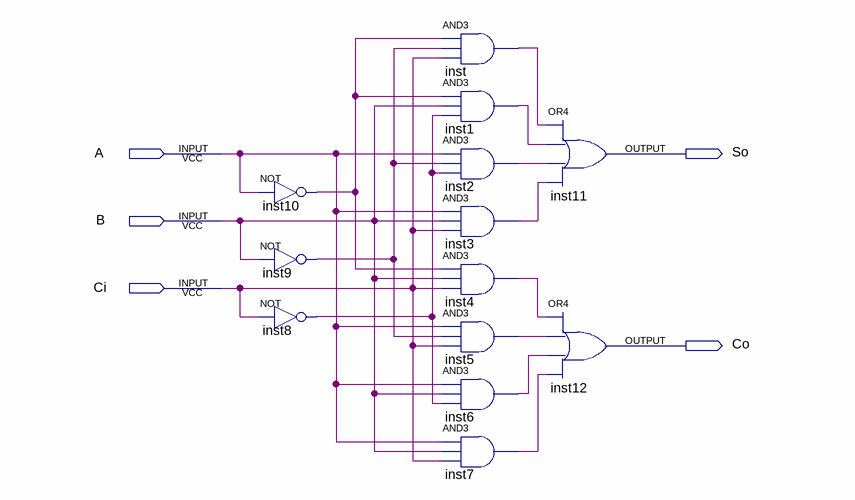
[diagram p0: schematic sheet]
// Quartus schematic Full_adder.bdf as structural Verilog: 13 symbols, 5 pins
module Full_adder (
  input  A,
  input  B,
  input  Ci,
  output So,
  output Co
);

  wire inst1_out, inst2_out, inst3_out, inst4_out, inst5_out, inst6_out, inst7_out, inst8_out, inst9_out,
       inst10_out, inst_out;

  not inst10 (inst10_out, A);
  not inst9 (inst9_out, B);
  not inst8 (inst8_out, Ci);
  and inst (inst_out, inst10_out, inst9_out, Ci);
  and inst1 (inst1_out, inst10_out, B, inst8_out);
  and inst2 (inst2_out, A, inst9_out, inst8_out);
  and inst3 (inst3_out, A, B, Ci);
  and inst4 (inst4_out, inst10_out, B, Ci);
  and inst5 (inst5_out, A, inst9_out, Ci);
  and inst6 (inst6_out, A, B, inst8_out);
  and inst7 (inst7_out, A, B, Ci);
  or inst11 (So, inst_out, inst1_out, inst2_out, inst3_out);
  or inst12 (Co, inst4_out, inst5_out, inst6_out, inst7_out);
endmodule
